# EAGLE schematic safebox (EAGLE 9.0.0)
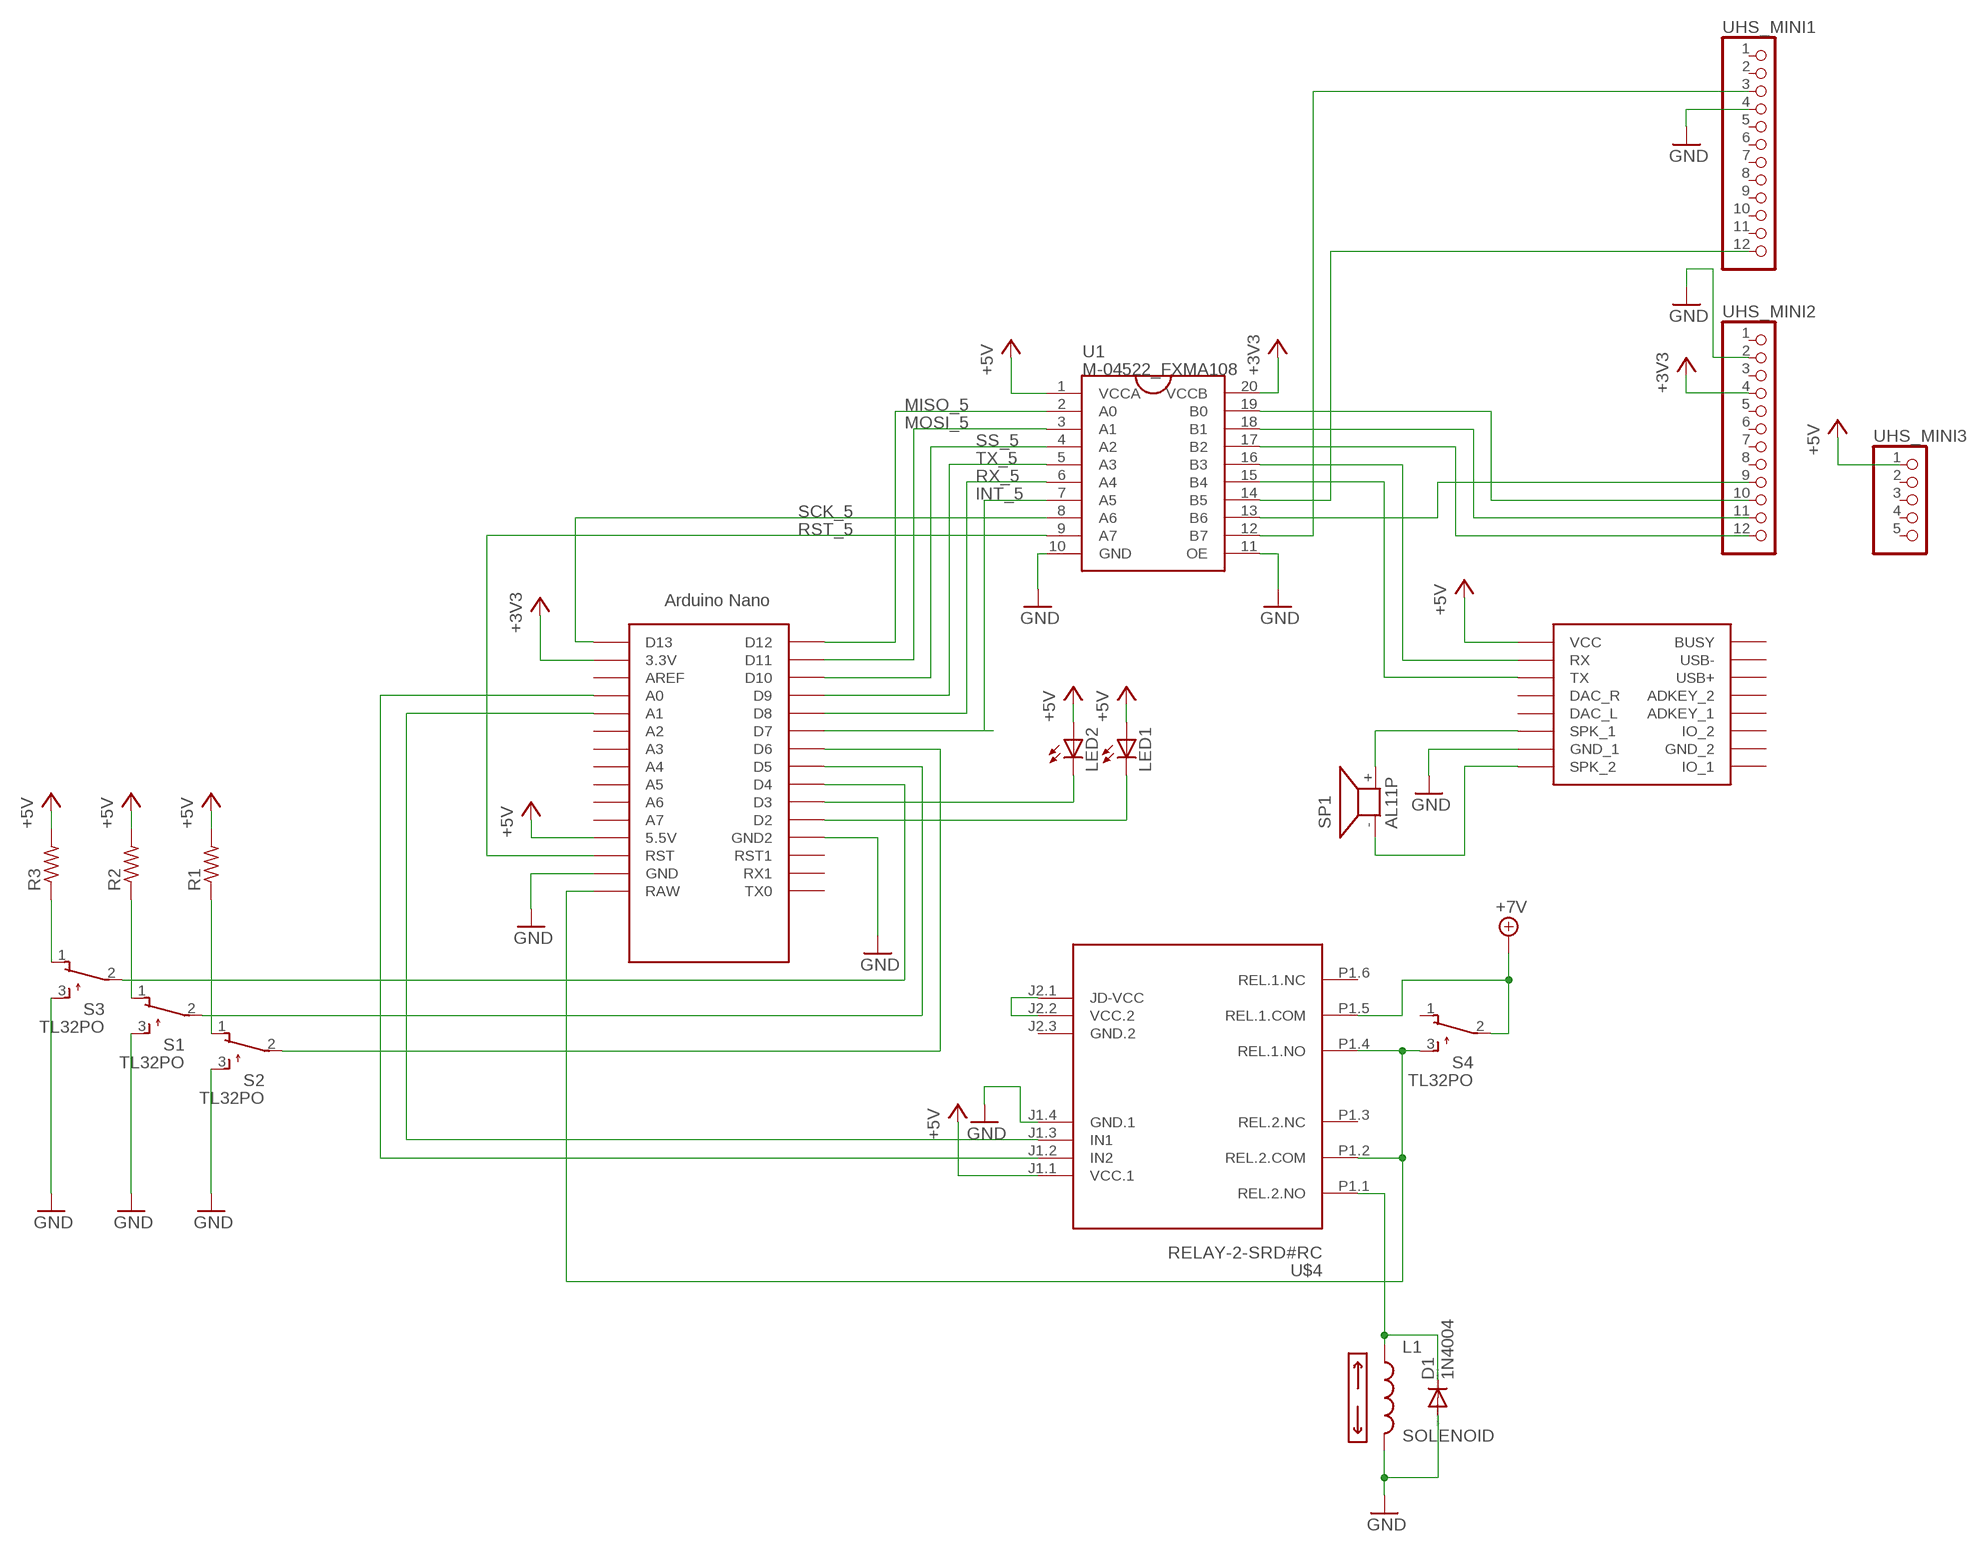
[diagram p0: schematic, sheet 1]

## Parts
D1  1N4004  [DO41-10]
L1  SOLENOID  [1X02]
LED1  LED10MM  [LED10MM]
LED2  LED10MM  [LED10MM]
R1  R-US_0207/12  [0207/12]
R2  R-US_0207/12  [0207/12]
R3  R-US_0207/12  [0207/12]
S1  TL32PO  [TL3XPO]
S2  TL32PO  [TL3XPO]
S3  TL32PO  [TL3XPO]
S4  TL32PO  [TL3XPO]
SP1  AL11P  [AL11P]
U1  M-04522_FXMA108  [FXMA108]
U$1  NANO  [NANO]
U$2  DFPLAYER  [DFPLAYER]
U$4  RELAY-2-SRD#RC  [RELAY-2-SRD#RC]
UHS_MINI1  PINHD-1X12  [1X12]
UHS_MINI2  PINHD-1X12  [1X12]
UHS_MINI3  PINHD-1X5  [1X05]

## Nets
+3V3: U1.20(VCCB) U$1.3.3V UHS_MINI2.4
+5V: LED1.A LED2.A R1.2 R2.2 R3.2 U1.1(VCCA) U$1.5V(5.5V) U$2.VCC U$4.J1.1(VCC.1) UHS_MINI3.1
+7V: S4.2(P) U$4.P1.5(REL.1.COM)
GND: D1.A L1.2 S1.3(S) S2.3(S) S3.3(S) U1.10(GND) U1.11(OE) U$1.GND U$1.GND1(GND2) U$2.GND_1 U$4.J1.4(GND.1) UHS_MINI1.4 UHS_MINI2.2
INT_5: U1.7(A5)
MISO_5: U1.2(A0) U$1.D12
MOSI_5: U1.3(A1) U$1.D11
N$1: U1.14(B5) UHS_MINI1.12
N$2: U1.17(B2) UHS_MINI2.12
N$3: U1.16(B3) U$2.RX
N$4: U1.15(B4) U$2.TX
N$5: SP1.+ U$2.SPK1(SPK_1)
N$6: SP1.- U$2.SPK2(SPK_2)
N$7: U1.18(B1) UHS_MINI2.11
N$8: U1.19(B0) UHS_MINI2.10
N$9: U1.13(B6) UHS_MINI2.9
N$10: U1.12(B7) UHS_MINI1.3
N$11: U$4.J2.1(JD-VCC) U$4.J2.2(VCC.2)
N$12: U$1.A0 U$4.J1.2(IN2)
N$13: U$1.A1 U$4.J1.3(IN1)
N$14: D1.C L1.1 U$4.P1.1(REL.2.NO)
N$15: R3.1 S3.1(O)
N$16: S3.2(P) U$1.D4
N$17: R1.1 S2.1(O)
N$18: R2.1 S1.1(O)
N$19: S1.2(P) U$1.D5
N$20: LED2.K(C) U$1.D3
N$21: LED1.K(C) U$1.D2
N$22: S2.2(P) U$1.D6
N$23: U$1.D7
N$24: S4.3(S) U$1.RAW U$4.P1.2(REL.2.COM) U$4.P1.4(REL.1.NO)
RST_5: U1.9(A7) U$1.RST
RX_5: U1.6(A4) U$1.D8
SCK_5: U1.8(A6) U$1.D13
SS_5: U1.4(A2) U$1.D10
TX_5: U1.5(A3) U$1.D9
Unconnected: S4.1(O) U$1.A2 U$1.A3 U$1.A4 U$1.A5 U$1.A6 U$1.A7 U$1.AREF U$1.ICSP1 U$1.ICSP2 U$1.ICSP3 U$1.ICSP4 U$1.ICSP5 U$1.ICSP6 U$1.RST1 U$1.RX1 U$1.TX0 U$2.ADKEY1(ADKEY_1) U$2.ADKEY2(ADKEY_2) U$2.BUSY U$2.DAC_L U$2.DAC_R U$2.GND_2 U$2.IO1(IO_1) U$2.IO2(IO_2) U$2.USB+ U$2.USB- U$4.P1.3(REL.2.NC) U$4.P1.6(REL.1.NC) UHS_MINI1.1 UHS_MINI1.2 UHS_MINI1.5 UHS_MINI1.6 UHS_MINI1.7 UHS_MINI1.8 UHS_MINI1.9 UHS_MINI1.10 UHS_MINI1.11 UHS_MINI2.1 UHS_MINI2.3 UHS_MINI2.5 UHS_MINI2.6 UHS_MINI2.7 UHS_MINI2.8 UHS_MINI3.2 UHS_MINI3.3 UHS_MINI3.4 UHS_MINI3.5

## Power pins joined to a net without a drawn wire
GND.2: U$4.J2.3(GND.2)

## Library data of the parts
D1 = diode:1N4004: DIODE general purpose rectifier, 1 A
L1 = my_mixed:SOLENOID
LED1 LED2 = led:LED: LED OSRAM: - CHIPLED LG R971, LG N971, LY N971, LG Q971, LY Q971, LO R971, LY R971 LH N974, LH R974 LS Q976, LO Q976, LY Q976 LO Q996 - Hyper CHIPLED LW Q18S LB Q993, LB Q99A, LB R99A - SideLED LS A670, LO A670, LY A670, LG A670, LP A670 LB A673, LV A673, LT A673, LW A673 LH A674 LY A675 LS A676, LA A676, LO A676, LY A676, LW A676 LS A679, LY A679, LG A679 - Hyper Micro SIDELED® LS Y876, LA Y876, LO Y876, LY Y876 LT Y87S - SmartLED LW L88C, LW L88S LB L89C, LB L89S, LG L890 LS L89K, LO L89K, LY L89K LS L896, LA L896, LO L896, LY L896 - TOPLED LS T670, LO T670, LY T670, LG T670, LP T670 LSG T670, LSP T670, LSY T670, LOP T670, LYG T670 LG T671, LOG T671, LSG T671 LB T673, LV T673, LT T673, LW T673 LH T674 LS T676, LA T676, LO T676, LY T676, LB T676, LH T676, LSB T676, LW T676 LB T67C, LV T67C, LT T67C, LS T67K, LO T67K, LY T67K, LW E67C LS E67B, LA E67B, LO E67B, LY E67B, LB E67C, LV E67C, LT E67C LW T67C LS T679, LY T679, LG T679 LS T770, LO T770, LY T770, LG T770, LP T770 LB T773, LV T773, LT T773, LW T773 LH T774 LS E675, LA E675, LY E675, LS T675 LS T776, LA T776, LO T776, LY T776, LB T776 LHGB T686 LT T68C, LB T68C - Hyper Mini TOPLED® LB M676 - Mini TOPLED Santana® LG M470 LS M47K, LO M47K, LY M47K Source: http://www.osram.convergy.de LUXEON: - LUMILED® LXK2-PW12-R00, LXK2-PW12-S00, LXK2-PW14-U00, LXK2-PW14-V00 LXK2-PM12-R00, LXK2-PM12-S00, LXK2-PM14-U00 LXK2-PE12-Q00, LXK2-PE12-R00, LXK2-PE12-S00, LXK2-PE14-T00, LXK2-PE14-U00 LXK2-PB12-K00, LXK2-PB12-L00, LXK2-PB12-M00, LXK2-PB14-N00, LXK2-PB14-P00, LXK2-PB14-Q00 LXK2-PR12-L00, LXK2-PR12-M00, LXK2-PR14-Q00, LXK2-PR14-R00 LXK2-PD12-Q00, LXK2-PD12-R00, LXK2-PD12-S00 LXK2-PH12-R00, LXK2-PH12-S00 LXK2-PL12-P00, LXK2-PL12-Q00, LXK2-PL12-R00 Source: www.luxeon.com KINGBRIGHT: KA-3528ASYC Source: www.kingbright.com
R1-R3 = resistor:R-US_: RESISTOR, American symbol
S1-S4 = switch:TL32PO: TINY SWITCH ON - MOM Source: http://www2.produktinfo.conrad.com/datenblaetter/700000-724999/705152-da-01-de-Subminiaturschalter_TL_36YO.pdf
SP1 = buzzer:AL11P: SPEAKER Source: Buerklin; OC_FARNELL: unknown; OC_NEWARK: unknown
U1 = Akizuki:M-04522_FXMA108
U$1 = Arduino-clone:NANO: Arduino Nano
U$2 = DFPlayer_v1:DFPLAYER
U$4 = diy-modules:RELAY-2-SRD#RC: 2-Channel Relay Module based on SRD-05VDC-SL-C relays Symbol with relays pins Click here to find device on ebay.com <http://www.ebay.com/sch/two+channel+relay+module+optocoupler+5v>
UHS_MINI1 UHS_MINI2 = pinhead:PINHD-1X12: PIN HEADER
UHS_MINI3 = pinhead:PINHD-1X5: PIN HEADER